# EasyEDA schematic SCH_ESC-IR2109_2025-11-01.json
TITLE: ESC-Sensored_IR2109; REV: 1.0; Date: 2025-07-23; Sheet: 1/1; Drawn By: Atithep
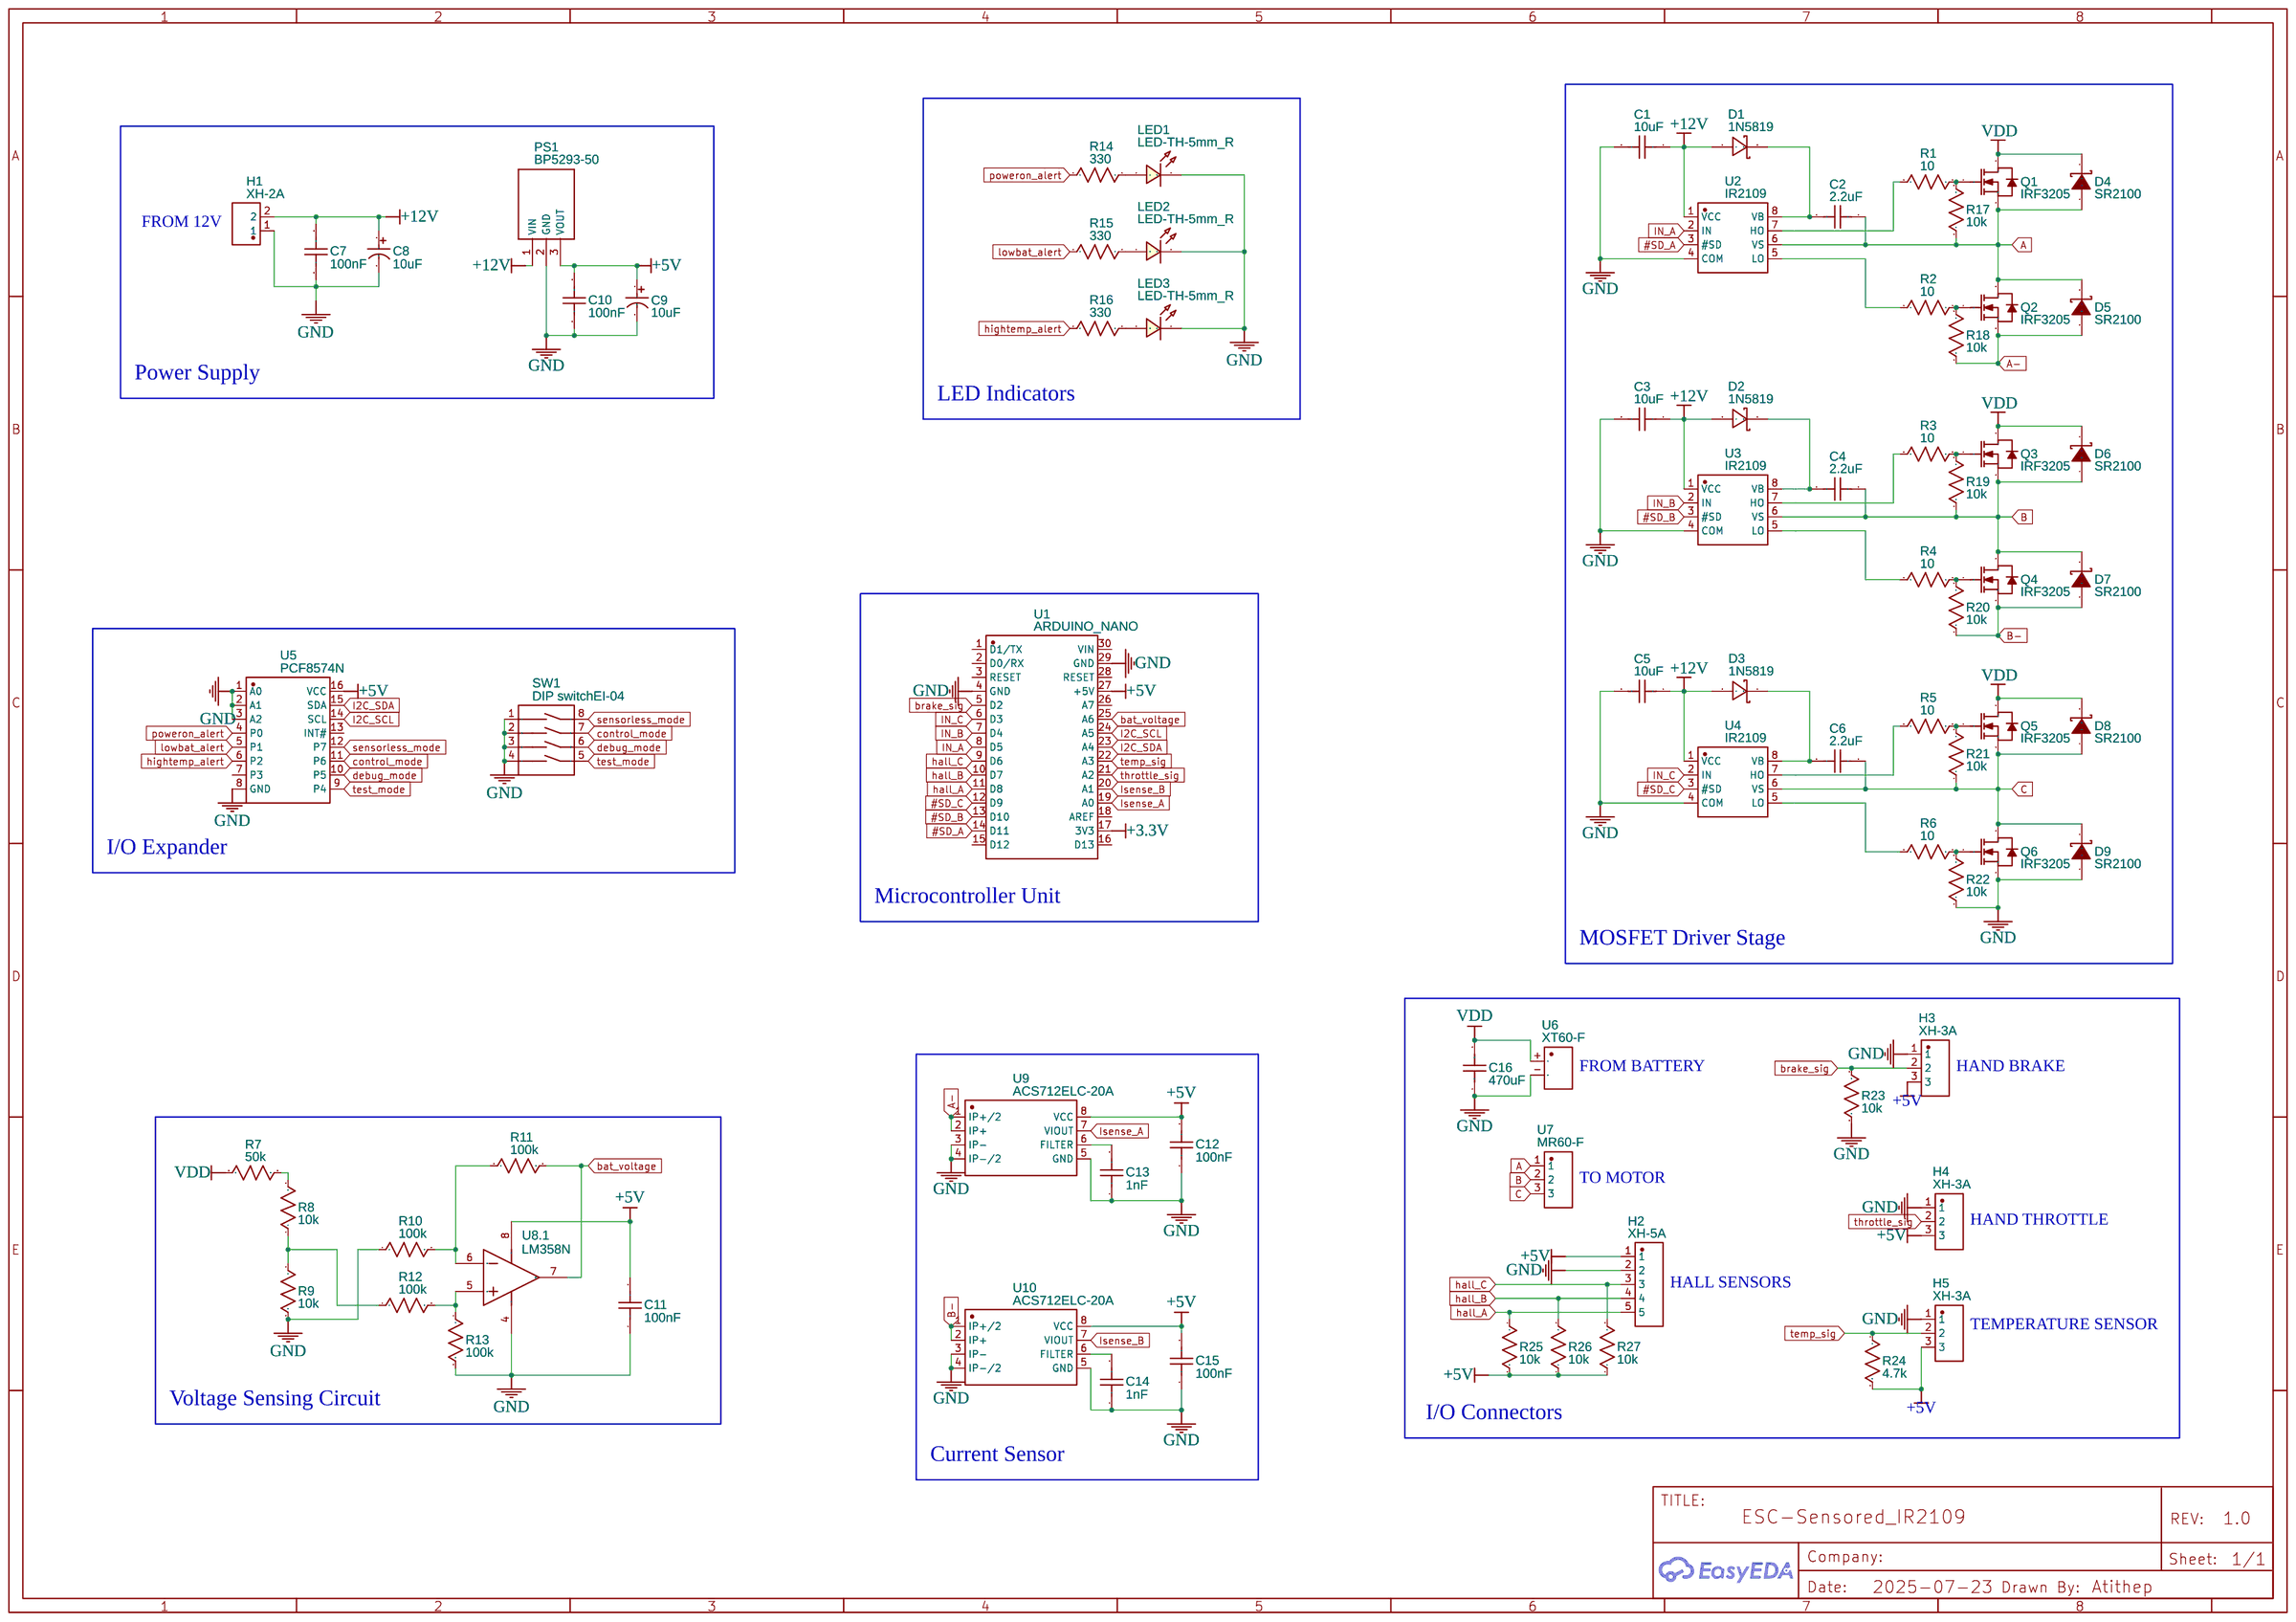
[diagram p0: schematic sheet]

## Parts
C1  10uF  [CAP-TH_L4.0-W3.5-P5.00-D0.5]
C2  2.2uF  [CAP-TH_L4.0-W3.5-P5.00-D0.5]
C3  10uF  [CAP-TH_L4.0-W3.5-P5.00-D0.5]
C4  2.2uF  [CAP-TH_L4.0-W3.5-P5.00-D0.5]
C5  10uF  [CAP-TH_L4.0-W3.5-P5.00-D0.5]
C6  2.2uF  [CAP-TH_L4.0-W3.5-P5.00-D0.5]
C7  100nF  [CAP-TH_L4.0-W3.5-P5.00-D0.5]
C8  10uF  [CAP-TH_BD5.0-P2.00-D0.8-FD]
C9  10uF  [CAP-TH_BD5.0-P2.00-D0.8-FD]
C10  100nF  [CAP-TH_L4.0-W3.5-P5.00-D0.5]
C11  100nF  [CAP-TH_L4.0-W3.5-P5.00-D0.5]
C12  100nF  [CAP-TH_L4.0-W3.5-P5.00-D0.5]
C13  1nF  [CAP-TH_L4.0-W3.5-P5.00-D0.5]
C14  1nF  [CAP-TH_L4.0-W3.5-P5.00-D0.5]
C15  100nF  [CAP-TH_L4.0-W3.5-P5.00-D0.5]
C16  470uF  [RAD-0.3]
D1  1N5819  [DO-41_BD2.4-L4.7-P8.70-D0.9-RD]
D2  1N5819  [DO-41_BD2.4-L4.7-P8.70-D0.9-RD]
D3  1N5819  [DO-41_BD2.4-L4.7-P8.70-D0.9-RD]
D4  SR2100  [DO-15_BD3.1-L6.7-P10.70-D0.9-FD]
D5  SR2100  [DO-15_BD3.1-L6.7-P10.70-D0.9-FD]
D6  SR2100  [DO-15_BD3.1-L6.7-P10.70-D0.9-FD]
D7  SR2100  [DO-15_BD3.1-L6.7-P10.70-D0.9-FD]
D8  SR2100  [DO-15_BD3.1-L6.7-P10.70-D0.9-FD]
D9  SR2100  [DO-15_BD3.1-L6.7-P10.70-D0.9-FD]
H1  XH-2A  [CONN-TH_XH-2A]
H2  XH-5A  [CONN-TH_XH-5A]
H3  XH-3A  [CONN-TH_XH-3A]
H4  XH-3A  [CONN-TH_XH-3A]
H5  XH-3A  [CONN-TH_XH-3A]
LED1  LED-TH-5mm_R  [LED-TH_BD5.0_RED]
LED2  LED-TH-5mm_R  [LED-TH_BD5.0_RED]
LED3  LED-TH-5mm_R  [LED-TH_BD5.0_RED]
PS1  BP5293-50  [TO254P570X1700X1780-3P]
Q1  IRF3205  [TO-220-3_L10.0-W4.6-P2.54-L]
Q2  IRF3205  [TO-220-3_L10.0-W4.6-P2.54-L]
Q3  IRF3205  [TO-220-3_L10.0-W4.6-P2.54-L]
Q4  IRF3205  [TO-220-3_L10.0-W4.6-P2.54-L]
Q5  IRF3205  [TO-220-3_L10.0-W4.6-P2.54-L]
Q6  IRF3205  [TO-220-3_L10.0-W4.6-P2.54-L]
R1  10  [R_AXIAL-0.4]
R2  10  [R_AXIAL-0.4]
R3  10  [R_AXIAL-0.4]
R4  10  [R_AXIAL-0.4]
R5  10  [R_AXIAL-0.4]
R6  10  [R_AXIAL-0.4]
R7  50k  [R_AXIAL-0.4]
R8  10k  [R_AXIAL-0.4]
R9  10k  [R_AXIAL-0.4]
R10  100k  [R_AXIAL-0.4]
R11  100k  [R_AXIAL-0.4]
R12  100k  [R_AXIAL-0.4]
R13  100k  [R_AXIAL-0.4]
R14  330  [R_AXIAL-0.4]
R15  330  [R_AXIAL-0.4]
R16  330  [R_AXIAL-0.4]
R17  10k  [R_AXIAL-0.4]
R18  10k  [R_AXIAL-0.4]
R19  10k  [R_AXIAL-0.4]
R20  10k  [R_AXIAL-0.4]
R21  10k  [R_AXIAL-0.4]
R22  10k  [R_AXIAL-0.4]
R23  10k  [R_AXIAL-0.4]
R24  4.7k  [R_AXIAL-0.4]
R25  10k  [R_AXIAL-0.4]
R26  10k  [R_AXIAL-0.4]
R27  10k  [R_AXIAL-0.4]
SW1  DIP switchEI-04  [SW-TH_DIPSWITCHEI-04]
U1  ARDUINO_NANO  [COMM-TH_ARDUINO_NANO]
U2  IR2109  [PDIP-8_L9.3-W6.4-P2.54-LS7.6-BL]
U3  IR2109  [PDIP-8_L9.3-W6.4-P2.54-LS7.6-BL]
U4  IR2109  [PDIP-8_L9.3-W6.4-P2.54-LS7.6-BL]
U5  PCF8574N  [PDIP-16_L19.3-W6.4-P2.54-LS7.9-BL]
U6  XT60-F  [CONN-TH_XT60PB-F]
U7  MR60-F  [CONN-TH_3P-P5.50_MR60-F]
U8  LM358N  [PDIP-8_L10.2-W5.9-P2.54-LS7.6-BL]  (section 1)
U9  ACS712ELC-20A  [SOIC-8_150MIL (INSIDE 0)]
U10  ACS712ELC-20A  [SOIC-8_150MIL (INSIDE 0)]

## Library data of the parts
C1-C7 C10-C15 = RDER71H104K0M1H03A: Contributor: LCSC; Supplier: LCSC; Supplier Part: C527620; Manufacturer: muRata(村田); JLCPCB Part Class: Extended Part
C8 = 10uF 25V 5*11: Supplier: LCSC; Manufacturer: CX(承兴); Manufacturer Part: KM106M025D11RR0VH2FP0; Supplier Part: C43347; JLCPCB Part Class: Extended Part
C9 = 100uF 25V 5*11: Supplier: LCSC; Manufacturer: CX(承兴); Manufacturer Part: KM107M025D11RR0VH2FP0; Supplier Part: C47873; JLCPCB Part Class: Extended Part
C16 = C_RAD-0.3_US: Contributor: LCEDA_Lib
D1-D3 = 1N5819RLG: Contributor: LCSC; Supplier: LCSC; Supplier Part: C88393; Manufacturer: onsemi(安森美); JLCPCB Part Class: Extended Part
D4-D9 = SR2100: Supplier: LCSC; Manufacturer: MDD(辰达半导体); Supplier Part: C15317; JLCPCB Part Class: Extended Part
H1 = XH-D-2A: Contributor: lcsc; Supplier: LCSC; Supplier Part: C5160911; Manufacturer: DEALON(德艺隆); JLCPCB Part Class: Extended Part
H2 = XH-5A_C722874: Contributor: LCSC; Supplier: LCSC; Supplier Part: C722874; Manufacturer: CAX(创都); JLCPCB Part Class: Extended Part
H3-H5 = ZX-HA2.54-3PZZ: Supplier: LCSC; Supplier Part: C7429615; Manufacturer: Megastar(兆星); JLCPCB Part Class: Extended Part; Contributor: lcsc
LED1-LED3 = LED-TH-5mm_R: Manufacturer: EVERLIGHT(台湾亿光); Manufacturer Part: 333-2SURD/S530-A3; Supplier Part: C87271; Supplier: LCSC; Contributor: LCEDA_Lib
PS1 = BP5293-50: Contributor: zerozaber2
Q1-Q6 = IRF3205: Supplier: LCSC; Supplier Part: C19189952; Manufacturer: minos(迈诺斯); Contributor: lcsc; JLCPCB Part Class: Extended Part
R1-R27 = R_AXIAL-0.4_US: Contributor: LCEDA_Lib
SW1 = DIP switchEI-04: Supplier: LCSC; Manufacturer: 圜达; Manufacturer Part: 拨码开关EI-04; Supplier Part: C99987; JLCPCB Part Class: Extended Part
U1 = ARDUINO_NANO: Contributor: lcsc; Supplier: LCSC; Supplier Part: C9900017879; Manufacturer: null; JLCPCB Part Class: Extended Part
U2-U4 = IR2109PBF: Contributor: LCSC; Supplier: LCSC; Supplier Part: C537552; Manufacturer: Infineon(英飞凌); JLCPCB Part Class: Extended Part
U5 = PCF8574N: Contributor: LCSC; Supplier: LCSC; Supplier Part: C2879047; Manufacturer: TI(德州仪器); JLCPCB Part Class: Extended Part
U6 = XT60-F: Contributor: lcsc; Supplier: LCSC; Supplier Part: C98734; Manufacturer: AMASS(艾迈斯); JLCPCB Part Class: Extended Part
U7 = MR60-F: Contributor: lcsc; Supplier: LCSC; Supplier Part: C9900023305; Manufacturer: null; JLCPCB Part Class: Extended Part
U8 = LM358N: subpart_no: 1; Supplier: LCSC; Supplier Part: C83405; Manufacturer: TI(德州仪器); Manufacturer Part: LM358N/NOPB; JLCPCB Part Class: Extended Part
U9 U10 = ACS712ELC-20A: Supplier: LCSC; Manufacturer: ALLEGRO; Manufacturer Part: ACS712ELCTR-05B-T; image: //image.lceda.cn/szlcsc/C44471.jpg; Supplier Part: C44471; Contributor: Andreika123

## Nets
+3.3V: U1.17(3V3)
+5V: C9.1 C10.2 C11.2 C12.2 C15.2 H2.1 H3.3 H4.3 H5.3 PS1.3(VOUT) R24.2 R25.2 R26.1 R27.1 U1.27(+5V) U5.16(VCC) U8.8(+V) U9.8(VCC) U10.8(VCC)
+12V: C1.1 C3.1 C5.1 C7.2 C8.1 D1.2(A) D2.2(A) D3.2(A) H1.2 PS1.1(VIN) U2.1(VCC) U3.1(VCC) U4.1(VCC)
GND: C1.2 C3.2 C5.2 C7.1 C8.2 C9.2 C10.1 C11.1 C12.1 C13.1 C14.1 C15.1 C16.1 D9.1(A) H1.1 H2.2 H3.1 H4.1 H5.1 LED1.2 LED2.2 LED3.2 PS1.2(GND) Q6.3(S) R9.2 R10.1 R13.2 R22.1 R23.2 SW1.1 SW1.2 SW1.3 SW1.4 U1.4(GND) U1.29(GND) U2.4(COM) U3.4(COM) U4.4(COM) U5.1(A0) U5.2(A1) U5.3(A2) U5.8(GND) U6.-(2) U8.4(-V) U9.3(IP-) U9.4(IP-/2) U9.5(GND) U10.3(IP-) U10.4(IP-/2) U10.5(GND)
VDD: C16.2 D4.2(K) D6.2(K) D8.2(K) Q1.2(D) Q3.2(D) Q5.2(D) R7.1 U6.+(1)
#SD_A: U1.14(D11) U2.3(#SD)
#SD_B: U1.13(D10) U3.3(#SD)
#SD_C: U1.12(D9) U4.3(#SD)
A: C2.1 D4.1(A) D5.2(K) Q1.3(S) Q2.2(D) R17.1 U2.6(VS) U7.1
A-: D5.1(A) Q2.3(S) R18.1 U9.1(IP+/2) U9.2(IP+)
B: C4.1 D6.1(A) D7.2(K) Q3.3(S) Q4.2(D) R19.1 U3.6(VS) U7.2
B-: D7.1(A) Q4.3(S) R20.1 U10.1(IP+/2) U10.2(IP+)
bat_voltage: R11.2 U1.25(A6) U8.7(OUT 2)
brake_sig: H3.2 R23.1 U1.5(D2)
C: C6.1 D8.1(A) D9.2(K) Q5.3(S) Q6.2(D) R21.1 U4.6(VS) U7.3
control_mode: SW1.7 U5.11(P6)
debug_mode: SW1.6 U5.10(P5)
hall_A: H2.5 R25.1 U1.11(D8)
hall_B: H2.4 R26.2 U1.10(D7)
hall_C: H2.3 R27.2 U1.9(D6)
hightemp_alert: R16.1 U5.6(P2)
I2C_SCL: U1.24(A5) U5.14(SCL)
I2C_SDA: U1.23(A4) U5.15(SDA)
IN_A: U1.8(D5) U2.2(IN)
IN_B: U1.7(D4) U3.2(IN)
IN_C: U1.6(D3) U4.2(IN)
Isense_A: U1.19(A0) U9.7(VIOUT)
Isense_B: U1.20(A1) U10.7(VIOUT)
lowbat_alert: R15.1 U5.5(P1)
poweron_alert: R14.1 U5.4(P0)
sensorless_mode: SW1.8 U5.12(P7)
temp_sig: H5.2 R24.1 U1.22(A3)
test_mode: SW1.5 U5.9(P4)
throttle_sig: H4.2 U1.21(A2)
Net-(C2-2): C2.2 D1.1(C) U2.8(VB)
Net-(C4-2): C4.2 D2.1(C) U3.8(VB)
Net-(C6-2): C6.2 D3.1(C) U4.8(VB)
Net-(C13-2): C13.2 U9.6(FILTER)
Net-(C14-2): C14.2 U10.6(FILTER)
Net-(LED1-1): LED1.1 R14.2
Net-(LED2-1): LED2.1 R15.2
Net-(LED3-1): LED3.1 R16.2
Net-(Q1-1): Q1.1(G) R1.2 R17.2
Net-(Q2-1): Q2.1(G) R2.2 R18.2
Net-(Q3-1): Q3.1(G) R3.2 R19.2
Net-(Q4-1): Q4.1(G) R4.2 R20.2
Net-(Q5-1): Q5.1(G) R5.2 R21.2
Net-(Q6-1): Q6.1(G) R6.2 R22.2
Net-(R1-1): R1.1 U2.7(HO)
Net-(R2-1): R2.1 U2.5(LO)
Net-(R3-1): R3.1 U3.7(HO)
Net-(R4-1): R4.1 U3.5(LO)
Net-(R5-1): R5.1 U4.7(HO)
Net-(R6-1): R6.1 U4.5(LO)
Net-(R7-2): R7.2 R8.2
Net-(R8-1): R8.1 R9.1 R12.1
Net-(R10-2): R10.2 R11.1 U8.6(-IN 2)
Net-(R12-2): R12.2 R13.1 U8.5(+IN 2)

Not connected (* = marked no-connect by the designer): U1 1(D1/TX) 2(D0/RX) 3(RESET) 15(D12) 16(D13) 18(AREF) 26(A7) 28(RESET) 30(VIN); U5 7(P3) 13(INT#)

## Notes on the sheet
- FROM 12V
- Power Supply
- LED Indicators
- I/O Expander
- Microcontroller Unit
- MOSFET Driver Stage
- FROM BATTERY
- HAND BRAKE
- TO MOTOR
- HAND THROTTLE
- HALL SENSORS
- TEMPERATURE SENSOR
- Voltage Sensing Circuit
- I/O Connectors
- Current Sensor
